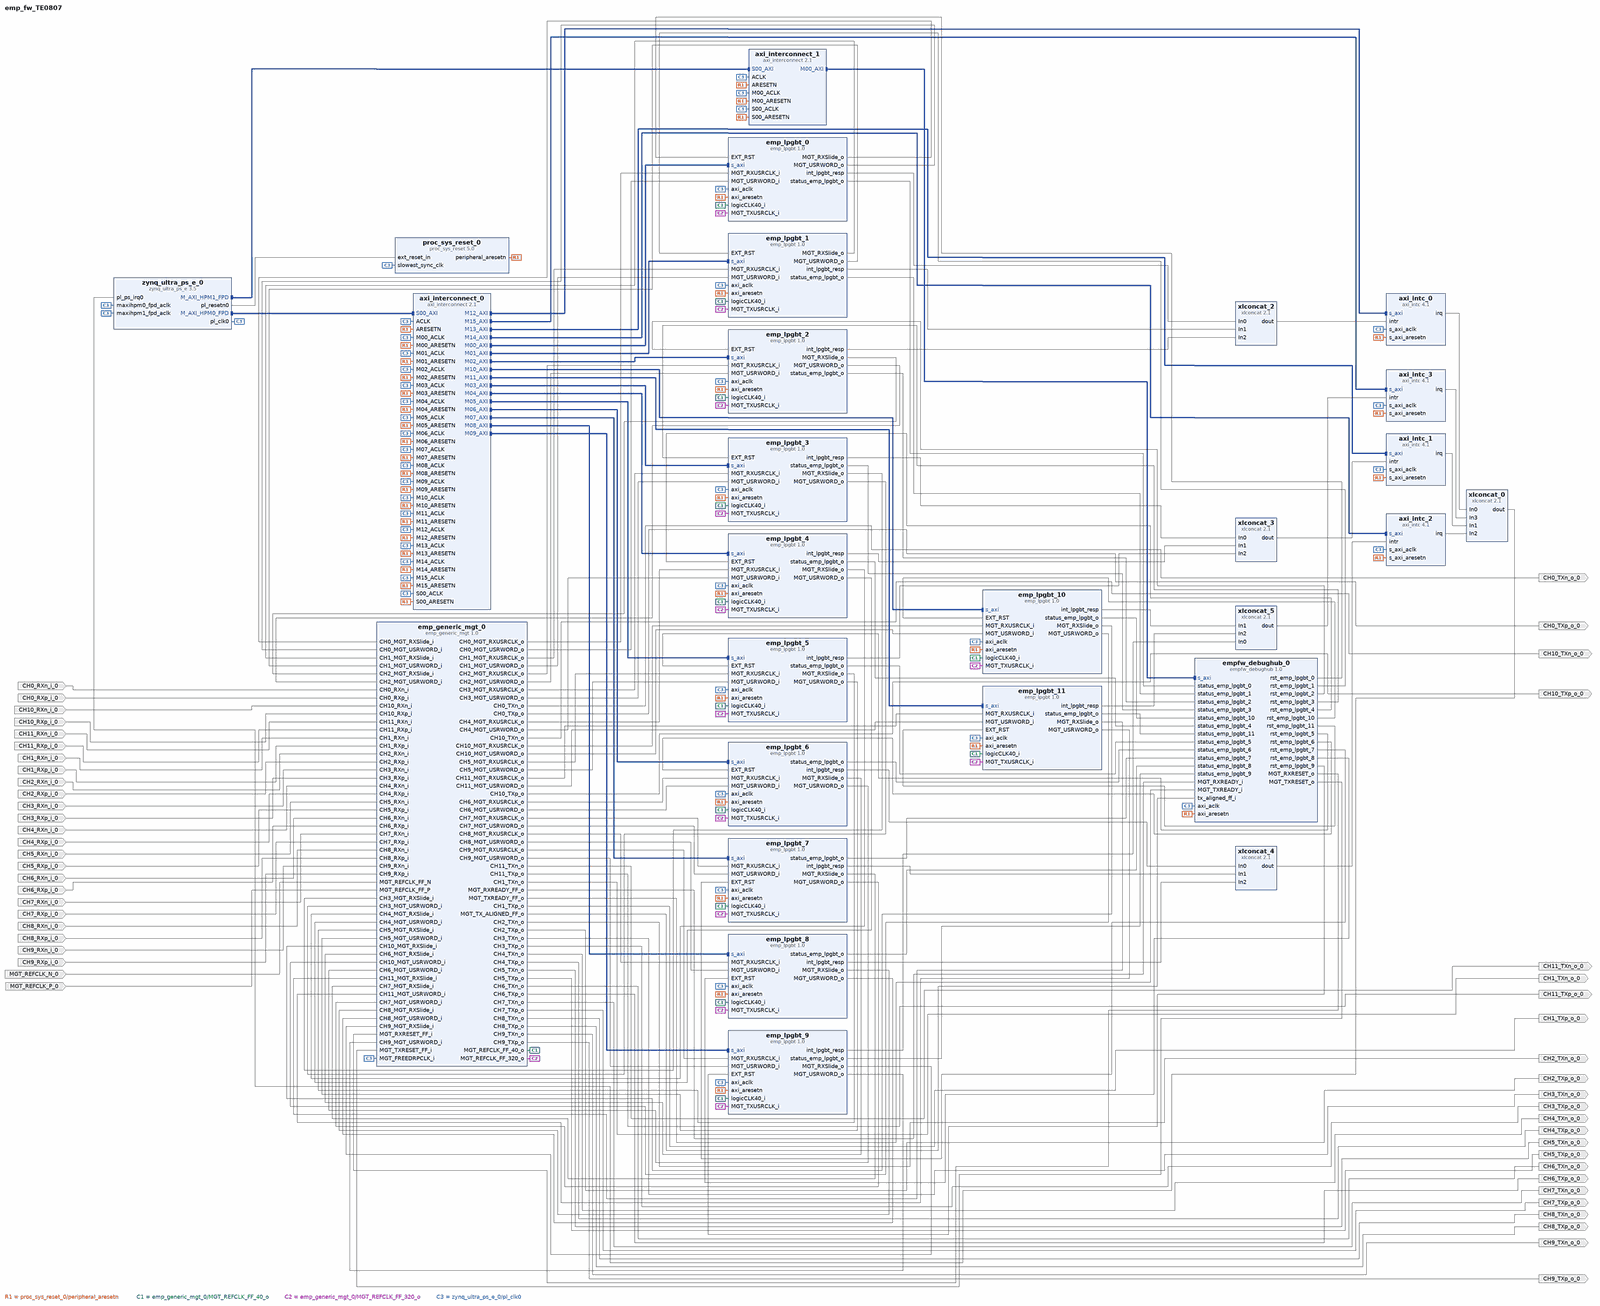
[diagram p0: block diagram of the top level, whole]
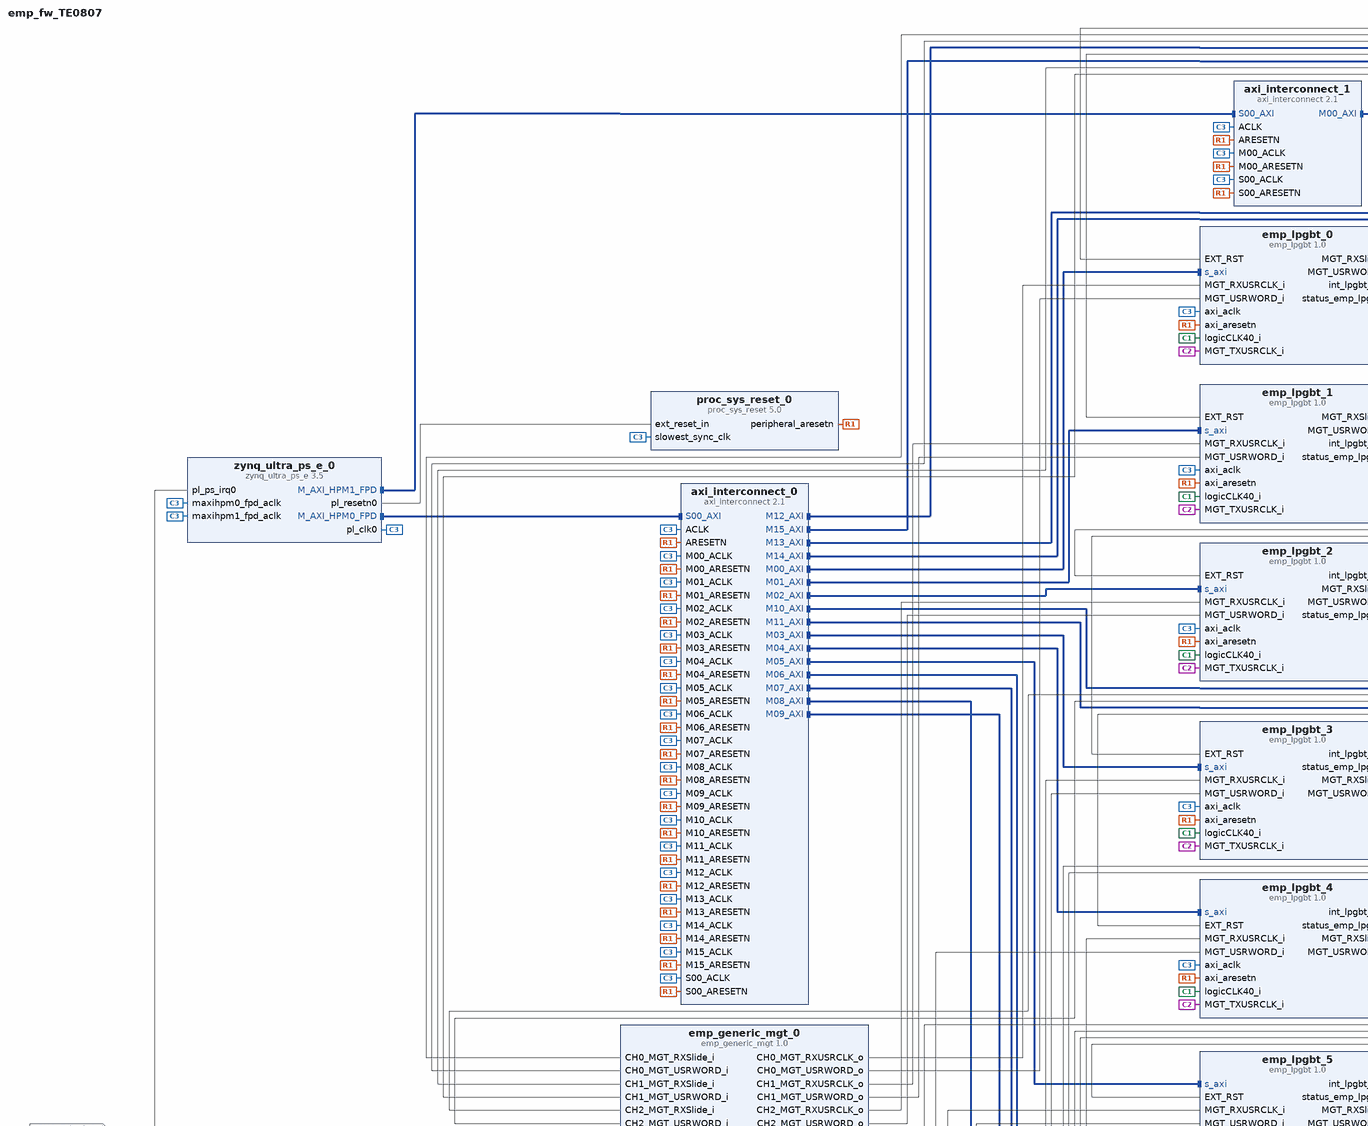
[diagram p1: block diagram of the top level, upper left part]
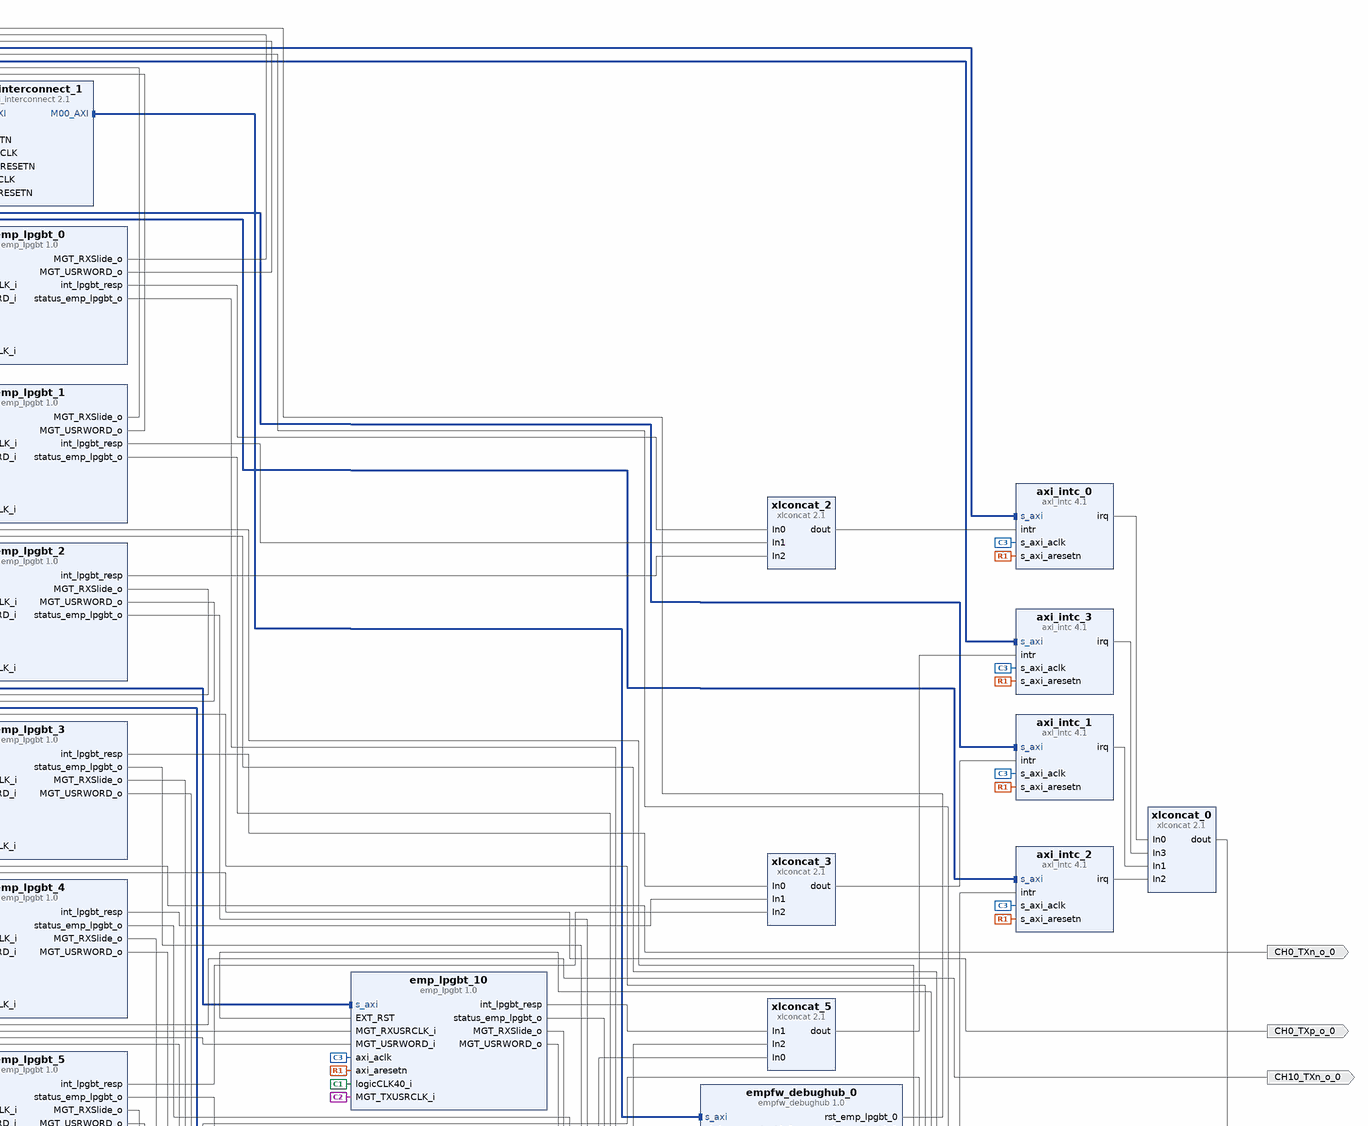
[diagram p2: block diagram of the top level, upper right part]
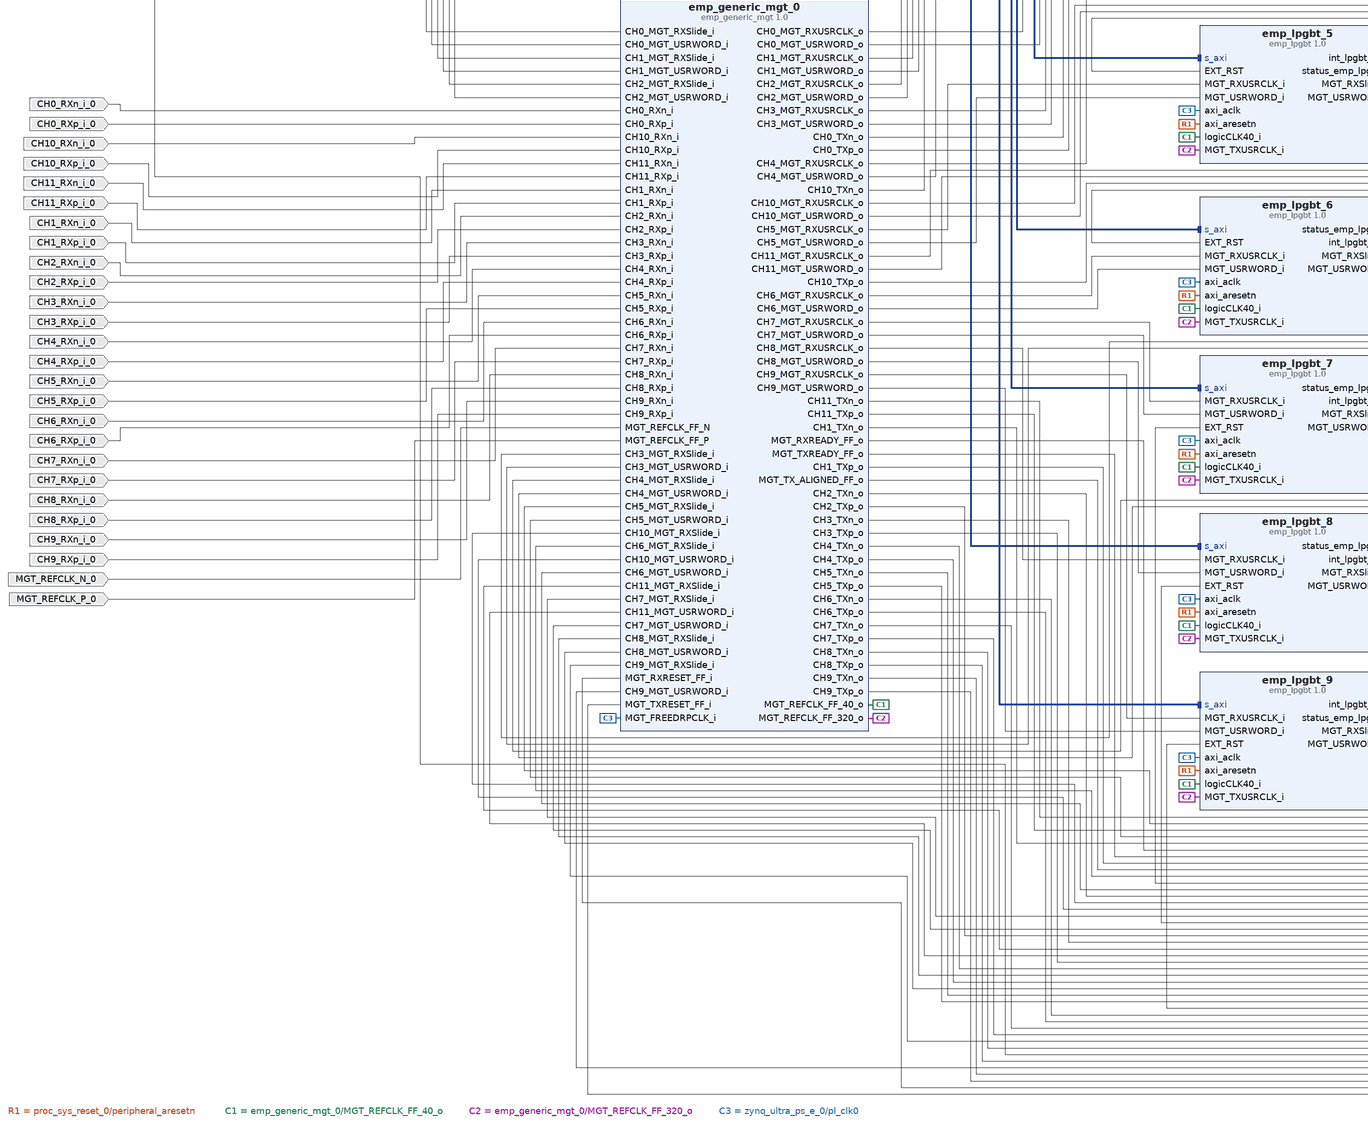
[diagram p3: block diagram of the top level, lower left part]
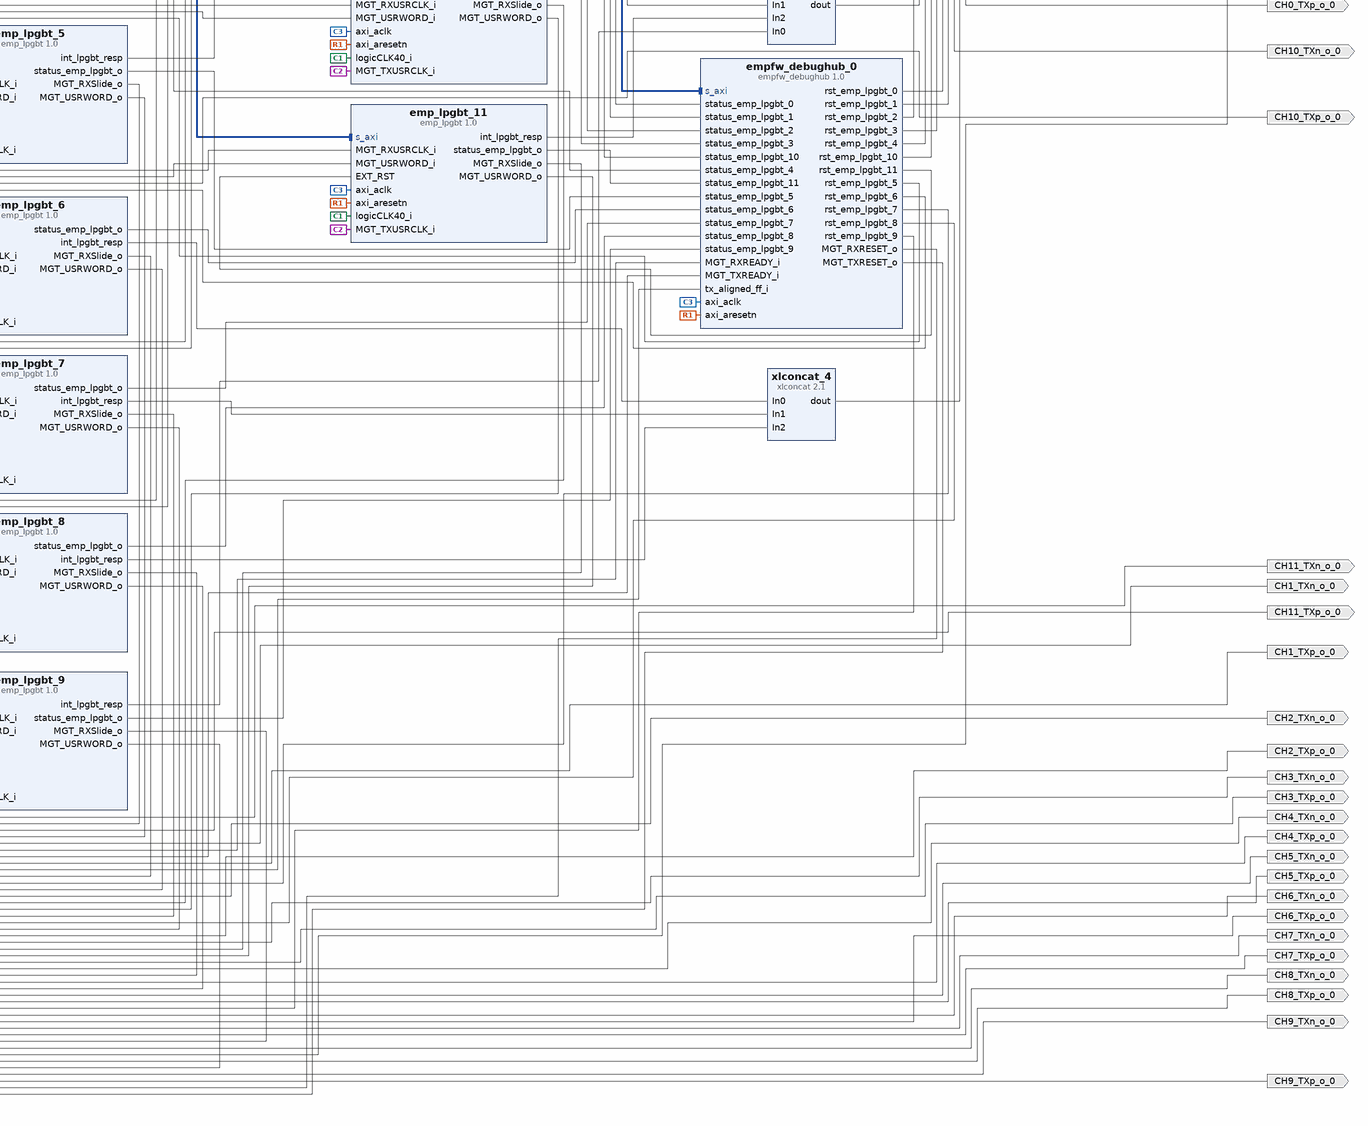
[diagram p4: block diagram of the top level, lower right part]
# Vivado block design emp_fw_TE0807, xczu4eg-fbvb900-1-e, Vivado 2023.2
create_bd_design emp_fw_TE0807

create_bd_port -dir O CH0_TXn_o_0
create_bd_port -dir O CH0_TXp_o_0
create_bd_port -dir O CH1_TXn_o_0
create_bd_port -dir O CH1_TXp_o_0
create_bd_port -dir O CH2_TXn_o_0
create_bd_port -dir O CH2_TXp_o_0
create_bd_port -dir O CH3_TXn_o_0
create_bd_port -dir O CH3_TXp_o_0
create_bd_port -dir O CH4_TXn_o_0
create_bd_port -dir O CH4_TXp_o_0
create_bd_port -dir O CH5_TXn_o_0
create_bd_port -dir O CH5_TXp_o_0
create_bd_port -dir O CH6_TXn_o_0
create_bd_port -dir O CH6_TXp_o_0
create_bd_port -dir O CH7_TXn_o_0
create_bd_port -dir O CH7_TXp_o_0
create_bd_port -dir O CH8_TXn_o_0
create_bd_port -dir O CH8_TXp_o_0
create_bd_port -dir O CH9_TXn_o_0
create_bd_port -dir O CH9_TXp_o_0
create_bd_port -dir O CH10_TXn_o_0
create_bd_port -dir O CH10_TXp_o_0
create_bd_port -dir O CH11_TXn_o_0
create_bd_port -dir O CH11_TXp_o_0
create_bd_port -dir I CH0_RXn_i_0
create_bd_port -dir I CH0_RXp_i_0
create_bd_port -dir I CH1_RXn_i_0
create_bd_port -dir I CH1_RXp_i_0
create_bd_port -dir I CH2_RXn_i_0
create_bd_port -dir I CH2_RXp_i_0
create_bd_port -dir I CH3_RXn_i_0
create_bd_port -dir I CH3_RXp_i_0
create_bd_port -dir I CH4_RXn_i_0
create_bd_port -dir I CH4_RXp_i_0
create_bd_port -dir I CH5_RXn_i_0
create_bd_port -dir I CH5_RXp_i_0
create_bd_port -dir I CH6_RXn_i_0
create_bd_port -dir I CH6_RXp_i_0
create_bd_port -dir I CH7_RXn_i_0
create_bd_port -dir I CH7_RXp_i_0
create_bd_port -dir I CH8_RXn_i_0
create_bd_port -dir I CH8_RXp_i_0
create_bd_port -dir I CH9_RXn_i_0
create_bd_port -dir I CH9_RXp_i_0
create_bd_port -dir I CH10_RXn_i_0
create_bd_port -dir I CH10_RXp_i_0
create_bd_port -dir I CH11_RXn_i_0
create_bd_port -dir I CH11_RXp_i_0
create_bd_port -dir I -type clk MGT_REFCLK_N_0
set_property -dict {CONFIG.FREQ_HZ 320000000} [get_bd_ports MGT_REFCLK_N_0]
create_bd_port -dir I -type clk MGT_REFCLK_P_0
set_property -dict {CONFIG.FREQ_HZ 320000000} [get_bd_ports MGT_REFCLK_P_0]

create_bd_cell -type ip -vlnv xilinx.com:ip:zynq_ultra_ps_e:3.5 zynq_ultra_ps_e_0
set_property -dict [list \
  CONFIG.CAN0_BOARD_INTERFACE custom \
  CONFIG.CAN1_BOARD_INTERFACE custom \
  CONFIG.CSU_BOARD_INTERFACE custom \
  CONFIG.DP_BOARD_INTERFACE custom \
  CONFIG.GEM0_BOARD_INTERFACE custom \
  CONFIG.GEM1_BOARD_INTERFACE custom \
  CONFIG.GEM2_BOARD_INTERFACE custom \
  CONFIG.GEM3_BOARD_INTERFACE custom \
  CONFIG.GPIO_BOARD_INTERFACE custom \
  CONFIG.IIC0_BOARD_INTERFACE custom \
  CONFIG.IIC1_BOARD_INTERFACE custom \
  CONFIG.NAND_BOARD_INTERFACE custom \
  CONFIG.PCIE_BOARD_INTERFACE custom \
  CONFIG.PJTAG_BOARD_INTERFACE custom \
  CONFIG.PMU_BOARD_INTERFACE custom \
  CONFIG.PSU_BANK_0_IO_STANDARD LVCMOS33 \
  CONFIG.PSU_BANK_1_IO_STANDARD LVCMOS33 \
  CONFIG.PSU_BANK_2_IO_STANDARD LVCMOS33 \
  CONFIG.PSU_BANK_3_IO_STANDARD LVCMOS33 \
  CONFIG.PSU_USB3__DUAL_CLOCK_ENABLE 1 \
  CONFIG.PSU__CAN1__PERIPHERAL__ENABLE 0 \
  CONFIG.PSU__CRF_APB__ACPU_CTRL__FREQMHZ 1200 \
  CONFIG.PSU__CRF_APB__ACPU_CTRL__SRCSEL APLL \
  CONFIG.PSU__CRF_APB__APLL_CTRL__SRCSEL PSS_REF_CLK \
  CONFIG.PSU__CRF_APB__DBG_FPD_CTRL__FREQMHZ 250 \
  CONFIG.PSU__CRF_APB__DBG_FPD_CTRL__SRCSEL IOPLL \
  CONFIG.PSU__CRF_APB__DBG_TRACE_CTRL__FREQMHZ 250 \
  CONFIG.PSU__CRF_APB__DBG_TRACE_CTRL__SRCSEL IOPLL \
  CONFIG.PSU__CRF_APB__DBG_TSTMP_CTRL__FREQMHZ 250 \
  CONFIG.PSU__CRF_APB__DBG_TSTMP_CTRL__SRCSEL IOPLL \
  CONFIG.PSU__CRF_APB__DDR_CTRL__FREQMHZ 1200 \
  CONFIG.PSU__CRF_APB__DDR_CTRL__SRCSEL DPLL \
  CONFIG.PSU__CRF_APB__DPDMA_REF_CTRL__FREQMHZ 600 \
  CONFIG.PSU__CRF_APB__DPDMA_REF_CTRL__SRCSEL DPLL \
  CONFIG.PSU__CRF_APB__DPLL_CTRL__SRCSEL PSS_REF_CLK \
  CONFIG.PSU__CRF_APB__DP_AUDIO_REF_CTRL__SRCSEL VPLL \
  CONFIG.PSU__CRF_APB__DP_STC_REF_CTRL__SRCSEL VPLL \
  CONFIG.PSU__CRF_APB__DP_VIDEO_REF_CTRL__SRCSEL DPLL \
  CONFIG.PSU__CRF_APB__GDMA_REF_CTRL__FREQMHZ 600 \
  CONFIG.PSU__CRF_APB__GDMA_REF_CTRL__SRCSEL DPLL \
  CONFIG.PSU__CRF_APB__GPU_REF_CTRL__FREQMHZ 600 \
  CONFIG.PSU__CRF_APB__GPU_REF_CTRL__SRCSEL DPLL \
  CONFIG.PSU__CRF_APB__TOPSW_LSBUS_CTRL__FREQMHZ 100 \
  CONFIG.PSU__CRF_APB__TOPSW_LSBUS_CTRL__SRCSEL IOPLL \
  CONFIG.PSU__CRF_APB__TOPSW_MAIN_CTRL__FREQMHZ 533.333 \
  CONFIG.PSU__CRF_APB__TOPSW_MAIN_CTRL__SRCSEL VPLL \
  CONFIG.PSU__CRF_APB__VPLL_CTRL__SRCSEL PSS_REF_CLK \
  CONFIG.PSU__CRL_APB__ADMA_REF_CTRL__FREQMHZ 500 \
  CONFIG.PSU__CRL_APB__ADMA_REF_CTRL__SRCSEL IOPLL \
  CONFIG.PSU__CRL_APB__CAN1_REF_CTRL__FREQMHZ 100 \
  CONFIG.PSU__CRL_APB__CAN1_REF_CTRL__SRCSEL IOPLL \
  CONFIG.PSU__CRL_APB__CPU_R5_CTRL__FREQMHZ 500 \
  CONFIG.PSU__CRL_APB__CPU_R5_CTRL__SRCSEL IOPLL \
  CONFIG.PSU__CRL_APB__DBG_LPD_CTRL__FREQMHZ 250 \
  CONFIG.PSU__CRL_APB__DBG_LPD_CTRL__SRCSEL IOPLL \
  CONFIG.PSU__CRL_APB__GEM3_REF_CTRL__FREQMHZ 125 \
  CONFIG.PSU__CRL_APB__GEM3_REF_CTRL__SRCSEL IOPLL \
  CONFIG.PSU__CRL_APB__I2C0_REF_CTRL__FREQMHZ 100 \
  CONFIG.PSU__CRL_APB__I2C0_REF_CTRL__SRCSEL IOPLL \
  CONFIG.PSU__CRL_APB__I2C1_REF_CTRL__FREQMHZ 100 \
  CONFIG.PSU__CRL_APB__I2C1_REF_CTRL__SRCSEL IOPLL \
  CONFIG.PSU__CRL_APB__IOPLL_CTRL__SRCSEL PSS_REF_CLK \
  CONFIG.PSU__CRL_APB__IOU_SWITCH_CTRL__FREQMHZ 267 \
  CONFIG.PSU__CRL_APB__IOU_SWITCH_CTRL__SRCSEL RPLL \
  CONFIG.PSU__CRL_APB__LPD_LSBUS_CTRL__FREQMHZ 100 \
  CONFIG.PSU__CRL_APB__LPD_LSBUS_CTRL__SRCSEL IOPLL \
  CONFIG.PSU__CRL_APB__LPD_SWITCH_CTRL__FREQMHZ 500 \
  CONFIG.PSU__CRL_APB__LPD_SWITCH_CTRL__SRCSEL IOPLL \
  CONFIG.PSU__CRL_APB__PCAP_CTRL__FREQMHZ 200 \
  CONFIG.PSU__CRL_APB__PCAP_CTRL__SRCSEL IOPLL \
  CONFIG.PSU__CRL_APB__PL0_REF_CTRL__FREQMHZ 100 \
  CONFIG.PSU__CRL_APB__PL0_REF_CTRL__SRCSEL RPLL \
  CONFIG.PSU__CRL_APB__QSPI_REF_CTRL__FREQMHZ 300 \
  CONFIG.PSU__CRL_APB__QSPI_REF_CTRL__SRCSEL IOPLL \
  CONFIG.PSU__CRL_APB__RPLL_CTRL__SRCSEL PSS_REF_CLK \
  CONFIG.PSU__CRL_APB__SDIO1_REF_CTRL__FREQMHZ 200 \
  CONFIG.PSU__CRL_APB__SDIO1_REF_CTRL__SRCSEL RPLL \
  CONFIG.PSU__CRL_APB__TIMESTAMP_REF_CTRL__FREQMHZ 100 \
  CONFIG.PSU__CRL_APB__TIMESTAMP_REF_CTRL__SRCSEL PSS_REF_CLK \
  CONFIG.PSU__CRL_APB__UART0_REF_CTRL__FREQMHZ 100 \
  CONFIG.PSU__CRL_APB__UART0_REF_CTRL__SRCSEL IOPLL \
  CONFIG.PSU__CRL_APB__UART1_REF_CTRL__FREQMHZ 100 \
  CONFIG.PSU__CRL_APB__UART1_REF_CTRL__SRCSEL IOPLL \
  CONFIG.PSU__CRL_APB__USB0_BUS_REF_CTRL__FREQMHZ 250 \
  CONFIG.PSU__CRL_APB__USB0_BUS_REF_CTRL__SRCSEL IOPLL \
  CONFIG.PSU__CRL_APB__USB3_DUAL_REF_CTRL__FREQMHZ 20 \
  CONFIG.PSU__CRL_APB__USB3_DUAL_REF_CTRL__SRCSEL IOPLL \
  CONFIG.PSU__CRL_APB__USB3__ENABLE 1 \
  CONFIG.PSU__CSUPMU__PERIPHERAL__VALID 0 \
  CONFIG.PSU__DDRC__BUS_WIDTH {64 Bit} \
  CONFIG.PSU__DDRC__COMPONENTS Components \
  CONFIG.PSU__DDRC__DEVICE_CAPACITY {8192 MBits} \
  CONFIG.PSU__DDRC__DRAM_WIDTH {16 Bits} \
  CONFIG.PSU__DDRC__ECC Disabled \
  CONFIG.PSU__DDRC__MEMORY_TYPE {DDR 4} \
  CONFIG.PSU__DDRC__SPEED_BIN DDR4_2400P \
  CONFIG.PSU__DDR_HIGH_ADDRESS_GUI_ENABLE 1 \
  CONFIG.PSU__DDR__INTERFACE__FREQMHZ 600.000 \
  CONFIG.PSU__DEVICE_TYPE EG \
  CONFIG.PSU__DISPLAYPORT__PERIPHERAL__ENABLE 0 \
  CONFIG.PSU__DLL__ISUSED 1 \
  CONFIG.PSU__ENET0__GRP_MDIO__ENABLE 1 \
  CONFIG.PSU__ENET0__GRP_MDIO__IO {MIO 76 .. 77} \
  CONFIG.PSU__ENET0__PERIPHERAL__ENABLE 1 \
  CONFIG.PSU__ENET0__PERIPHERAL__IO {MIO 26 .. 37} \
  CONFIG.PSU__ENET3__FIFO__ENABLE 0 \
  CONFIG.PSU__ENET3__GRP_MDIO__ENABLE 0 \
  CONFIG.PSU__ENET3__PERIPHERAL__ENABLE 1 \
  CONFIG.PSU__ENET3__PERIPHERAL__IO {MIO 64 .. 75} \
  CONFIG.PSU__ENET3__PTP__ENABLE 0 \
  CONFIG.PSU__ENET3__TSU__ENABLE 0 \
  CONFIG.PSU__FPGA_PL0_ENABLE 1 \
  CONFIG.PSU__GEM3_COHERENCY 0 \
  CONFIG.PSU__GEM3_ROUTE_THROUGH_FPD 0 \
  CONFIG.PSU__GEM__TSU__ENABLE 0 \
  CONFIG.PSU__GPIO0_MIO__IO {MIO 0 .. 25} \
  CONFIG.PSU__GPIO0_MIO__PERIPHERAL__ENABLE 1 \
  CONFIG.PSU__GPIO1_MIO__PERIPHERAL__ENABLE 0 \
  CONFIG.PSU__I2C0__PERIPHERAL__ENABLE 1 \
  CONFIG.PSU__I2C0__PERIPHERAL__IO {MIO 38 .. 39} \
  CONFIG.PSU__I2C1__PERIPHERAL__ENABLE 0 \
  CONFIG.PSU__IOU_SLCR__IOU_TTC_APB_CLK__TTC0_SEL APB \
  CONFIG.PSU__IOU_SLCR__IOU_TTC_APB_CLK__TTC1_SEL APB \
  CONFIG.PSU__IOU_SLCR__IOU_TTC_APB_CLK__TTC2_SEL APB \
  CONFIG.PSU__IOU_SLCR__IOU_TTC_APB_CLK__TTC3_SEL APB \
  CONFIG.PSU__LPD_SLCR__CSUPMU__FREQMHZ 100 \
  CONFIG.PSU__MAXIGP0__DATA_WIDTH 128 \
  CONFIG.PSU__OVERRIDE_HPX_QOS 0 \
  CONFIG.PSU__OVERRIDE__BASIC_CLOCK 0 \
  CONFIG.PSU__PMU__PERIPHERAL__ENABLE 0 \
  CONFIG.PSU__PRESET_APPLIED 0 \
  CONFIG.PSU__PSS_REF_CLK__FREQMHZ 33.333 \
  CONFIG.PSU__QSPI_COHERENCY 0 \
  CONFIG.PSU__QSPI_ROUTE_THROUGH_FPD 0 \
  CONFIG.PSU__QSPI__GRP_FBCLK__ENABLE 1 \
  CONFIG.PSU__QSPI__GRP_FBCLK__IO {MIO 6} \
  CONFIG.PSU__QSPI__PERIPHERAL__DATA_MODE x4 \
  CONFIG.PSU__QSPI__PERIPHERAL__ENABLE 1 \
  CONFIG.PSU__QSPI__PERIPHERAL__IO {MIO 0 .. 12} \
  CONFIG.PSU__QSPI__PERIPHERAL__MODE {Dual Parallel} \
  CONFIG.PSU__SATA__PERIPHERAL__ENABLE 0 \
  CONFIG.PSU__SD0__CLK_200_SDR_OTAP_DLY 0x3 \
  CONFIG.PSU__SD0__CLK_50_DDR_ITAP_DLY 0x12 \
  CONFIG.PSU__SD0__CLK_50_DDR_OTAP_DLY 0x6 \
  CONFIG.PSU__SD0__CLK_50_SDR_ITAP_DLY 0x15 \
  CONFIG.PSU__SD0__CLK_50_SDR_OTAP_DLY 0x6 \
  CONFIG.PSU__SD0__DATA_TRANSFER_MODE 8Bit \
  CONFIG.PSU__SD0__GRP_POW__ENABLE 1 \
  CONFIG.PSU__SD0__GRP_POW__IO {MIO 23} \
  CONFIG.PSU__SD0__PERIPHERAL__ENABLE 1 \
  CONFIG.PSU__SD0__PERIPHERAL__IO {MIO 13 .. 22} \
  CONFIG.PSU__SD0__RESET__ENABLE 1 \
  CONFIG.PSU__SD0__SLOT_TYPE eMMC \
  CONFIG.PSU__SD1_COHERENCY 0 \
  CONFIG.PSU__SD1_ROUTE_THROUGH_FPD 0 \
  CONFIG.PSU__SD1__CLK_50_SDR_ITAP_DLY 0x15 \
  CONFIG.PSU__SD1__CLK_50_SDR_OTAP_DLY 0x5 \
  CONFIG.PSU__SD1__DATA_TRANSFER_MODE 4Bit \
  CONFIG.PSU__SD1__GRP_CD__ENABLE 1 \
  CONFIG.PSU__SD1__GRP_CD__IO {MIO 45} \
  CONFIG.PSU__SD1__GRP_POW__ENABLE 0 \
  CONFIG.PSU__SD1__GRP_WP__ENABLE 1 \
  CONFIG.PSU__SD1__GRP_WP__IO {MIO 44} \
  CONFIG.PSU__SD1__PERIPHERAL__ENABLE 1 \
  CONFIG.PSU__SD1__PERIPHERAL__IO {MIO 46 .. 51} \
  CONFIG.PSU__SD1__SLOT_TYPE {SD 2.0} \
  CONFIG.PSU__SWDT0__CLOCK__ENABLE 0 \
  CONFIG.PSU__SWDT0__PERIPHERAL__ENABLE 1 \
  CONFIG.PSU__SWDT0__RESET__ENABLE 0 \
  CONFIG.PSU__SWDT1__CLOCK__ENABLE 0 \
  CONFIG.PSU__SWDT1__PERIPHERAL__ENABLE 1 \
  CONFIG.PSU__SWDT1__RESET__ENABLE 0 \
  CONFIG.PSU__TSU__BUFG_PORT_PAIR 0 \
  CONFIG.PSU__TTC0__CLOCK__ENABLE 0 \
  CONFIG.PSU__TTC0__PERIPHERAL__ENABLE 1 \
  CONFIG.PSU__TTC0__WAVEOUT__ENABLE 0 \
  CONFIG.PSU__TTC1__CLOCK__ENABLE 0 \
  CONFIG.PSU__TTC1__PERIPHERAL__ENABLE 1 \
  CONFIG.PSU__TTC1__WAVEOUT__ENABLE 0 \
  CONFIG.PSU__TTC2__CLOCK__ENABLE 0 \
  CONFIG.PSU__TTC2__PERIPHERAL__ENABLE 1 \
  CONFIG.PSU__TTC2__WAVEOUT__ENABLE 0 \
  CONFIG.PSU__TTC3__CLOCK__ENABLE 0 \
  CONFIG.PSU__TTC3__PERIPHERAL__ENABLE 1 \
  CONFIG.PSU__TTC3__WAVEOUT__ENABLE 0 \
  CONFIG.PSU__UART0__BAUD_RATE 115200 \
  CONFIG.PSU__UART0__MODEM__ENABLE 0 \
  CONFIG.PSU__UART0__PERIPHERAL__ENABLE 1 \
  CONFIG.PSU__UART0__PERIPHERAL__IO {MIO 42 .. 43} \
  CONFIG.PSU__UART1__PERIPHERAL__ENABLE 0 \
  CONFIG.PSU__USB0_COHERENCY 0 \
  CONFIG.PSU__USB0__PERIPHERAL__ENABLE 1 \
  CONFIG.PSU__USB0__PERIPHERAL__IO {MIO 52 .. 63} \
  CONFIG.PSU__USB0__REF_CLK_FREQ 100 \
  CONFIG.PSU__USB0__REF_CLK_SEL {Ref Clk2} \
  CONFIG.PSU__USB2_0__EMIO__ENABLE 0 \
  CONFIG.PSU__USB3_0__EMIO__ENABLE 0 \
  CONFIG.PSU__USB3_0__PERIPHERAL__ENABLE 1 \
  CONFIG.PSU__USB3_0__PERIPHERAL__IO {GT Lane1} \
  CONFIG.PSU__USB__RESET__MODE {Boot Pin} \
  CONFIG.PSU__USB__RESET__POLARITY {Active Low} \
  CONFIG.PSU__USE__IRQ0 1 \
  CONFIG.PSU__USE__IRQ1 1 \
  CONFIG.PSU__USE__M_AXI_GP0 1 \
  CONFIG.PSU__USE__M_AXI_GP1 1 \
  CONFIG.PSU__USE__M_AXI_GP2 0 \
  CONFIG.QSPI_BOARD_INTERFACE custom \
  CONFIG.SATA_BOARD_INTERFACE custom \
  CONFIG.SD0_BOARD_INTERFACE custom \
  CONFIG.SD1_BOARD_INTERFACE custom \
  CONFIG.SPI0_BOARD_INTERFACE custom \
  CONFIG.SPI1_BOARD_INTERFACE custom \
  CONFIG.SUBPRESET1 Custom \
  CONFIG.SUBPRESET2 Custom \
  CONFIG.SWDT0_BOARD_INTERFACE custom \
  CONFIG.SWDT1_BOARD_INTERFACE custom \
  CONFIG.TRACE_BOARD_INTERFACE custom \
  CONFIG.TTC0_BOARD_INTERFACE custom \
  CONFIG.TTC1_BOARD_INTERFACE custom \
  CONFIG.TTC2_BOARD_INTERFACE custom \
  CONFIG.TTC3_BOARD_INTERFACE custom \
  CONFIG.UART0_BOARD_INTERFACE custom \
  CONFIG.UART1_BOARD_INTERFACE custom \
  CONFIG.USB0_BOARD_INTERFACE custom \
  CONFIG.USB1_BOARD_INTERFACE custom \
  CONFIG.preset None \
] [get_bd_cells zynq_ultra_ps_e_0]
# 714 more settings of zynq_ultra_ps_e_0 are not shown: defaults, MIO pin electricals, DDR timing, and values the tool derives
create_bd_cell -type ip -vlnv user.org:user:emp_lpgbt:1.0 emp_lpgbt_0
create_bd_cell -type ip -vlnv xilinx.com:ip:proc_sys_reset:5.0 proc_sys_reset_0
set_property -dict {CONFIG.C_AUX_RESET_HIGH 0} [get_bd_cells proc_sys_reset_0]
create_bd_cell -type ip -vlnv xilinx.com:ip:axi_interconnect:2.1 axi_interconnect_0
set_property -dict {CONFIG.NUM_MI 16} [get_bd_cells axi_interconnect_0]
create_bd_cell -type ip -vlnv user.org:user:emp_lpgbt:1.0 emp_lpgbt_1
set_property -dict {CONFIG.BASEADDR 0xA0010000} [get_bd_cells emp_lpgbt_1]
create_bd_cell -type ip -vlnv user.org:user:emp_lpgbt:1.0 emp_lpgbt_2
set_property -dict {CONFIG.BASEADDR 0xA0020000} [get_bd_cells emp_lpgbt_2]
create_bd_cell -type ip -vlnv user.org:user:emp_lpgbt:1.0 emp_lpgbt_3
set_property -dict {CONFIG.BASEADDR 0xA0030000} [get_bd_cells emp_lpgbt_3]
create_bd_cell -type ip -vlnv user.org:user:emp_lpgbt:1.0 emp_lpgbt_5
set_property -dict {CONFIG.BASEADDR 0xA0050000} [get_bd_cells emp_lpgbt_5]
create_bd_cell -type ip -vlnv user.org:user:emp_lpgbt:1.0 emp_lpgbt_6
set_property -dict {CONFIG.BASEADDR 0xA0060000} [get_bd_cells emp_lpgbt_6]
create_bd_cell -type ip -vlnv user.org:user:emp_lpgbt:1.0 emp_lpgbt_7
set_property -dict {CONFIG.BASEADDR 0xA0070000} [get_bd_cells emp_lpgbt_7]
create_bd_cell -type ip -vlnv user.org:user:emp_lpgbt:1.0 emp_lpgbt_8
set_property -dict {CONFIG.BASEADDR 0xA0080000} [get_bd_cells emp_lpgbt_8]
create_bd_cell -type ip -vlnv user.org:user:emp_lpgbt:1.0 emp_lpgbt_9
set_property -dict {CONFIG.BASEADDR 0xA0090000} [get_bd_cells emp_lpgbt_9]
create_bd_cell -type ip -vlnv user.org:user:emp_lpgbt:1.0 emp_lpgbt_10
set_property -dict {CONFIG.BASEADDR 0xA00A0000} [get_bd_cells emp_lpgbt_10]
create_bd_cell -type ip -vlnv user.org:user:emp_lpgbt:1.0 emp_lpgbt_11
set_property -dict {CONFIG.BASEADDR 0xA00B0000} [get_bd_cells emp_lpgbt_11]
create_bd_cell -type ip -vlnv xilinx.com:ip:xlconcat:2.1 xlconcat_0
set_property -dict {CONFIG.NUM_PORTS 4} [get_bd_cells xlconcat_0]
create_bd_cell -type ip -vlnv xilinx.com:ip:axi_interconnect:2.1 axi_interconnect_1
set_property -dict {CONFIG.NUM_MI 1} [get_bd_cells axi_interconnect_1]
create_bd_cell -type ip -vlnv user.org:user:emp_lpgbt:1.0 emp_lpgbt_4
set_property -dict {CONFIG.BASEADDR 0xA0040000} [get_bd_cells emp_lpgbt_4]
create_bd_cell -type ip -vlnv user.org:user:empfw_debughub:1.0 empfw_debughub_0
create_bd_cell -type ip -vlnv user.org:user:emp_generic_mgt:1.0 emp_generic_mgt_0
set_property -dict [list \
  CONFIG.g_COM_SEL 0 \
  CONFIG.g_MGT_FF_RX_POLARITY_inv 0xE07 \
  CONFIG.g_MGT_FF_TX_POLARITY_inv 0xFFF \
] [get_bd_cells emp_generic_mgt_0]
create_bd_cell -type ip -vlnv xilinx.com:ip:xlconcat:2.1 xlconcat_2
set_property -dict {CONFIG.NUM_PORTS 3} [get_bd_cells xlconcat_2]
create_bd_cell -type ip -vlnv xilinx.com:ip:xlconcat:2.1 xlconcat_3
set_property -dict {CONFIG.NUM_PORTS 3} [get_bd_cells xlconcat_3]
create_bd_cell -type ip -vlnv xilinx.com:ip:xlconcat:2.1 xlconcat_4
set_property -dict {CONFIG.NUM_PORTS 3} [get_bd_cells xlconcat_4]
create_bd_cell -type ip -vlnv xilinx.com:ip:xlconcat:2.1 xlconcat_5
set_property -dict {CONFIG.NUM_PORTS 3} [get_bd_cells xlconcat_5]
create_bd_cell -type ip -vlnv xilinx.com:ip:axi_intc:4.1 axi_intc_0
set_property -dict {CONFIG.C_IRQ_CONNECTION 1} [get_bd_cells axi_intc_0]
create_bd_cell -type ip -vlnv xilinx.com:ip:axi_intc:4.1 axi_intc_1
set_property -dict {CONFIG.C_IRQ_CONNECTION 1} [get_bd_cells axi_intc_1]
create_bd_cell -type ip -vlnv xilinx.com:ip:axi_intc:4.1 axi_intc_2
set_property -dict {CONFIG.C_IRQ_CONNECTION 1} [get_bd_cells axi_intc_2]
create_bd_cell -type ip -vlnv xilinx.com:ip:axi_intc:4.1 axi_intc_3
set_property -dict {CONFIG.C_IRQ_CONNECTION 1} [get_bd_cells axi_intc_3]

# ---- connections ----

connect_bd_intf_net [get_bd_intf_pins emp_lpgbt_0/s_axi] [get_bd_intf_pins axi_interconnect_0/M00_AXI]
connect_bd_intf_net [get_bd_intf_pins emp_lpgbt_1/s_axi] [get_bd_intf_pins axi_interconnect_0/M01_AXI]
connect_bd_intf_net [get_bd_intf_pins emp_lpgbt_2/s_axi] [get_bd_intf_pins axi_interconnect_0/M02_AXI]
connect_bd_intf_net [get_bd_intf_pins emp_lpgbt_3/s_axi] [get_bd_intf_pins axi_interconnect_0/M03_AXI]
connect_bd_intf_net [get_bd_intf_pins emp_lpgbt_4/s_axi] [get_bd_intf_pins axi_interconnect_0/M04_AXI]
connect_bd_intf_net [get_bd_intf_pins emp_lpgbt_5/s_axi] [get_bd_intf_pins axi_interconnect_0/M05_AXI]
connect_bd_intf_net [get_bd_intf_pins emp_lpgbt_6/s_axi] [get_bd_intf_pins axi_interconnect_0/M06_AXI]
connect_bd_intf_net [get_bd_intf_pins emp_lpgbt_7/s_axi] [get_bd_intf_pins axi_interconnect_0/M07_AXI]
connect_bd_intf_net [get_bd_intf_pins emp_lpgbt_8/s_axi] [get_bd_intf_pins axi_interconnect_0/M08_AXI]
connect_bd_intf_net [get_bd_intf_pins emp_lpgbt_9/s_axi] [get_bd_intf_pins axi_interconnect_0/M09_AXI]
connect_bd_intf_net [get_bd_intf_pins emp_lpgbt_10/s_axi] [get_bd_intf_pins axi_interconnect_0/M10_AXI]
connect_bd_intf_net [get_bd_intf_pins emp_lpgbt_11/s_axi] [get_bd_intf_pins axi_interconnect_0/M11_AXI]
connect_bd_intf_net [get_bd_intf_pins axi_intc_0/s_axi] [get_bd_intf_pins axi_interconnect_0/M12_AXI]
connect_bd_intf_net [get_bd_intf_pins axi_intc_1/s_axi] [get_bd_intf_pins axi_interconnect_0/M13_AXI]
connect_bd_intf_net [get_bd_intf_pins axi_intc_2/s_axi] [get_bd_intf_pins axi_interconnect_0/M14_AXI]
connect_bd_intf_net [get_bd_intf_pins axi_intc_3/s_axi] [get_bd_intf_pins axi_interconnect_0/M15_AXI]
connect_bd_intf_net [get_bd_intf_pins axi_interconnect_1/M00_AXI] [get_bd_intf_pins empfw_debughub_0/s_axi]
connect_bd_intf_net [get_bd_intf_pins zynq_ultra_ps_e_0/M_AXI_HPM0_FPD] [get_bd_intf_pins axi_interconnect_0/S00_AXI]
connect_bd_intf_net [get_bd_intf_pins zynq_ultra_ps_e_0/M_AXI_HPM1_FPD] [get_bd_intf_pins axi_interconnect_1/S00_AXI]
connect_bd_net -net CH0_RXn_i_0_1 [get_bd_ports CH0_RXn_i_0] [get_bd_pins emp_generic_mgt_0/CH0_RXn_i]
connect_bd_net -net CH0_RXp_i_0_1 [get_bd_ports CH0_RXp_i_0] [get_bd_pins emp_generic_mgt_0/CH0_RXp_i]
connect_bd_net -net CH10_RXn_i_0_1 [get_bd_ports CH10_RXn_i_0] [get_bd_pins emp_generic_mgt_0/CH10_RXn_i]
connect_bd_net -net CH10_RXp_i_0_1 [get_bd_ports CH10_RXp_i_0] [get_bd_pins emp_generic_mgt_0/CH10_RXp_i]
connect_bd_net -net CH11_RXn_i_0_1 [get_bd_ports CH11_RXn_i_0] [get_bd_pins emp_generic_mgt_0/CH11_RXn_i]
connect_bd_net -net CH11_RXp_i_0_1 [get_bd_ports CH11_RXp_i_0] [get_bd_pins emp_generic_mgt_0/CH11_RXp_i]
connect_bd_net -net CH1_RXn_i_0_1 [get_bd_ports CH1_RXn_i_0] [get_bd_pins emp_generic_mgt_0/CH1_RXn_i]
connect_bd_net -net CH1_RXp_i_0_1 [get_bd_ports CH1_RXp_i_0] [get_bd_pins emp_generic_mgt_0/CH1_RXp_i]
connect_bd_net -net CH2_RXn_i_0_1 [get_bd_ports CH2_RXn_i_0] [get_bd_pins emp_generic_mgt_0/CH2_RXn_i]
connect_bd_net -net CH2_RXp_i_0_1 [get_bd_ports CH2_RXp_i_0] [get_bd_pins emp_generic_mgt_0/CH2_RXp_i]
connect_bd_net -net CH3_RXn_i_0_1 [get_bd_ports CH3_RXn_i_0] [get_bd_pins emp_generic_mgt_0/CH3_RXn_i]
connect_bd_net -net CH3_RXp_i_0_1 [get_bd_ports CH3_RXp_i_0] [get_bd_pins emp_generic_mgt_0/CH3_RXp_i]
connect_bd_net -net CH4_RXn_i_0_1 [get_bd_ports CH4_RXn_i_0] [get_bd_pins emp_generic_mgt_0/CH4_RXn_i]
connect_bd_net -net CH4_RXp_i_0_1 [get_bd_ports CH4_RXp_i_0] [get_bd_pins emp_generic_mgt_0/CH4_RXp_i]
connect_bd_net -net CH5_RXn_i_0_1 [get_bd_ports CH5_RXn_i_0] [get_bd_pins emp_generic_mgt_0/CH5_RXn_i]
connect_bd_net -net CH5_RXp_i_0_1 [get_bd_ports CH5_RXp_i_0] [get_bd_pins emp_generic_mgt_0/CH5_RXp_i]
connect_bd_net -net CH6_RXn_i_0_1 [get_bd_ports CH6_RXn_i_0] [get_bd_pins emp_generic_mgt_0/CH6_RXn_i]
connect_bd_net -net CH6_RXp_i_0_1 [get_bd_ports CH6_RXp_i_0] [get_bd_pins emp_generic_mgt_0/CH6_RXp_i]
connect_bd_net -net CH7_RXn_i_0_1 [get_bd_ports CH7_RXn_i_0] [get_bd_pins emp_generic_mgt_0/CH7_RXn_i]
connect_bd_net -net CH7_RXp_i_0_1 [get_bd_ports CH7_RXp_i_0] [get_bd_pins emp_generic_mgt_0/CH7_RXp_i]
connect_bd_net -net CH8_RXn_i_0_1 [get_bd_ports CH8_RXn_i_0] [get_bd_pins emp_generic_mgt_0/CH8_RXn_i]
connect_bd_net -net CH8_RXp_i_0_1 [get_bd_ports CH8_RXp_i_0] [get_bd_pins emp_generic_mgt_0/CH8_RXp_i]
connect_bd_net -net CH9_RXn_i_0_1 [get_bd_ports CH9_RXn_i_0] [get_bd_pins emp_generic_mgt_0/CH9_RXn_i]
connect_bd_net -net CH9_RXp_i_0_1 [get_bd_ports CH9_RXp_i_0] [get_bd_pins emp_generic_mgt_0/CH9_RXp_i]
connect_bd_net -net M12_ARESETN_1 [get_bd_pins proc_sys_reset_0/peripheral_aresetn] \
  [get_bd_pins axi_interconnect_0/M11_ARESETN] [get_bd_pins axi_interconnect_0/M10_ARESETN] \
  [get_bd_pins axi_interconnect_0/M09_ARESETN] [get_bd_pins axi_interconnect_0/M08_ARESETN] \
  [get_bd_pins axi_interconnect_0/M07_ARESETN] [get_bd_pins axi_interconnect_0/M06_ARESETN] \
  [get_bd_pins axi_interconnect_0/M05_ARESETN] [get_bd_pins axi_interconnect_0/M04_ARESETN] \
  [get_bd_pins axi_interconnect_0/M03_ARESETN] [get_bd_pins axi_interconnect_0/M02_ARESETN] \
  [get_bd_pins axi_interconnect_0/M01_ARESETN] [get_bd_pins axi_interconnect_0/M00_ARESETN] \
  [get_bd_pins axi_interconnect_0/S00_ARESETN] [get_bd_pins axi_interconnect_0/ARESETN] \
  [get_bd_pins axi_interconnect_1/ARESETN] [get_bd_pins axi_interconnect_1/S00_ARESETN] \
  [get_bd_pins axi_interconnect_1/M00_ARESETN] [get_bd_pins emp_lpgbt_0/axi_aresetn] [get_bd_pins emp_lpgbt_10/axi_aresetn] \
  [get_bd_pins emp_lpgbt_11/axi_aresetn] [get_bd_pins emp_lpgbt_1/axi_aresetn] [get_bd_pins emp_lpgbt_2/axi_aresetn] \
  [get_bd_pins emp_lpgbt_3/axi_aresetn] [get_bd_pins emp_lpgbt_4/axi_aresetn] [get_bd_pins emp_lpgbt_5/axi_aresetn] \
  [get_bd_pins emp_lpgbt_6/axi_aresetn] [get_bd_pins emp_lpgbt_7/axi_aresetn] [get_bd_pins emp_lpgbt_8/axi_aresetn] \
  [get_bd_pins emp_lpgbt_9/axi_aresetn] [get_bd_pins empfw_debughub_0/axi_aresetn] [get_bd_pins axi_intc_3/s_axi_aresetn] \
  [get_bd_pins axi_intc_2/s_axi_aresetn] [get_bd_pins axi_intc_1/s_axi_aresetn] [get_bd_pins axi_intc_0/s_axi_aresetn] \
  [get_bd_pins axi_interconnect_0/M15_ARESETN] [get_bd_pins axi_interconnect_0/M14_ARESETN] \
  [get_bd_pins axi_interconnect_0/M13_ARESETN] [get_bd_pins axi_interconnect_0/M12_ARESETN]
connect_bd_net -net MGT_REFCLK_N_0_1 [get_bd_ports MGT_REFCLK_N_0] [get_bd_pins emp_generic_mgt_0/MGT_REFCLK_FF_N]
connect_bd_net -net MGT_REFCLK_P_0_1 [get_bd_ports MGT_REFCLK_P_0] [get_bd_pins emp_generic_mgt_0/MGT_REFCLK_FF_P]
connect_bd_net [get_bd_pins emp_generic_mgt_0/MGT_REFCLK_FF_40_o] \
  [get_bd_pins emp_lpgbt_7/logicCLK40_i] [get_bd_pins emp_lpgbt_6/logicCLK40_i] [get_bd_pins emp_lpgbt_2/logicCLK40_i] \
  [get_bd_pins emp_lpgbt_1/logicCLK40_i] [get_bd_pins emp_lpgbt_0/logicCLK40_i] [get_bd_pins emp_lpgbt_3/logicCLK40_i] \
  [get_bd_pins emp_lpgbt_4/logicCLK40_i] [get_bd_pins emp_lpgbt_8/logicCLK40_i] [get_bd_pins emp_lpgbt_11/logicCLK40_i] \
  [get_bd_pins emp_lpgbt_9/logicCLK40_i] [get_bd_pins emp_lpgbt_5/logicCLK40_i] [get_bd_pins emp_lpgbt_10/logicCLK40_i]
connect_bd_net [get_bd_pins emp_generic_mgt_0/MGT_REFCLK_FF_320_o] \
  [get_bd_pins emp_lpgbt_0/MGT_TXUSRCLK_i] [get_bd_pins emp_lpgbt_10/MGT_TXUSRCLK_i] \
  [get_bd_pins emp_lpgbt_11/MGT_TXUSRCLK_i] [get_bd_pins emp_lpgbt_1/MGT_TXUSRCLK_i] [get_bd_pins emp_lpgbt_2/MGT_TXUSRCLK_i] \
  [get_bd_pins emp_lpgbt_3/MGT_TXUSRCLK_i] [get_bd_pins emp_lpgbt_4/MGT_TXUSRCLK_i] [get_bd_pins emp_lpgbt_5/MGT_TXUSRCLK_i] \
  [get_bd_pins emp_lpgbt_6/MGT_TXUSRCLK_i] [get_bd_pins emp_lpgbt_7/MGT_TXUSRCLK_i] [get_bd_pins emp_lpgbt_8/MGT_TXUSRCLK_i] \
  [get_bd_pins emp_lpgbt_9/MGT_TXUSRCLK_i]
connect_bd_net [get_bd_pins axi_intc_0/irq] [get_bd_pins xlconcat_0/In0]
connect_bd_net [get_bd_pins axi_intc_1/irq] [get_bd_pins xlconcat_0/In1]
connect_bd_net [get_bd_pins axi_intc_2/irq] [get_bd_pins xlconcat_0/In2]
connect_bd_net [get_bd_pins axi_intc_3/irq] [get_bd_pins xlconcat_0/In3]
connect_bd_net [get_bd_pins emp_generic_mgt_0/CH0_MGT_RXUSRCLK_o] [get_bd_pins emp_lpgbt_0/MGT_RXUSRCLK_i]
connect_bd_net [get_bd_pins emp_generic_mgt_0/CH0_MGT_USRWORD_o] [get_bd_pins emp_lpgbt_0/MGT_USRWORD_i]
connect_bd_net [get_bd_pins emp_generic_mgt_0/CH0_TXn_o] [get_bd_ports CH0_TXn_o_0]
connect_bd_net [get_bd_pins emp_generic_mgt_0/CH0_TXp_o] [get_bd_ports CH0_TXp_o_0]
connect_bd_net [get_bd_pins emp_generic_mgt_0/CH10_MGT_RXUSRCLK_o] [get_bd_pins emp_lpgbt_10/MGT_RXUSRCLK_i]
connect_bd_net [get_bd_pins emp_generic_mgt_0/CH10_MGT_USRWORD_o] [get_bd_pins emp_lpgbt_10/MGT_USRWORD_i]
connect_bd_net [get_bd_pins emp_generic_mgt_0/CH10_TXn_o] [get_bd_ports CH10_TXn_o_0]
connect_bd_net [get_bd_pins emp_generic_mgt_0/CH10_TXp_o] [get_bd_ports CH10_TXp_o_0]
connect_bd_net [get_bd_pins emp_generic_mgt_0/CH11_MGT_RXUSRCLK_o] [get_bd_pins emp_lpgbt_11/MGT_RXUSRCLK_i]
connect_bd_net [get_bd_pins emp_generic_mgt_0/CH11_MGT_USRWORD_o] [get_bd_pins emp_lpgbt_11/MGT_USRWORD_i]
connect_bd_net [get_bd_pins emp_generic_mgt_0/CH11_TXn_o] [get_bd_ports CH11_TXn_o_0]
connect_bd_net [get_bd_pins emp_generic_mgt_0/CH11_TXp_o] [get_bd_ports CH11_TXp_o_0]
connect_bd_net [get_bd_pins emp_generic_mgt_0/CH1_MGT_RXUSRCLK_o] [get_bd_pins emp_lpgbt_1/MGT_RXUSRCLK_i]
connect_bd_net [get_bd_pins emp_generic_mgt_0/CH1_MGT_USRWORD_o] [get_bd_pins emp_lpgbt_1/MGT_USRWORD_i]
connect_bd_net [get_bd_pins emp_generic_mgt_0/CH1_TXn_o] [get_bd_ports CH1_TXn_o_0]
connect_bd_net [get_bd_pins emp_generic_mgt_0/CH1_TXp_o] [get_bd_ports CH1_TXp_o_0]
connect_bd_net [get_bd_pins emp_generic_mgt_0/CH2_MGT_RXUSRCLK_o] [get_bd_pins emp_lpgbt_2/MGT_RXUSRCLK_i]
connect_bd_net [get_bd_pins emp_generic_mgt_0/CH2_MGT_USRWORD_o] [get_bd_pins emp_lpgbt_2/MGT_USRWORD_i]
connect_bd_net [get_bd_pins emp_generic_mgt_0/CH2_TXn_o] [get_bd_ports CH2_TXn_o_0]
connect_bd_net [get_bd_pins emp_generic_mgt_0/CH2_TXp_o] [get_bd_ports CH2_TXp_o_0]
connect_bd_net [get_bd_pins emp_generic_mgt_0/CH3_MGT_RXUSRCLK_o] [get_bd_pins emp_lpgbt_3/MGT_RXUSRCLK_i]
connect_bd_net [get_bd_pins emp_generic_mgt_0/CH3_MGT_USRWORD_o] [get_bd_pins emp_lpgbt_3/MGT_USRWORD_i]
connect_bd_net [get_bd_pins emp_generic_mgt_0/CH3_TXn_o] [get_bd_ports CH3_TXn_o_0]
connect_bd_net [get_bd_pins emp_generic_mgt_0/CH3_TXp_o] [get_bd_ports CH3_TXp_o_0]
connect_bd_net [get_bd_pins emp_generic_mgt_0/CH4_MGT_RXUSRCLK_o] [get_bd_pins emp_lpgbt_4/MGT_RXUSRCLK_i]
connect_bd_net [get_bd_pins emp_generic_mgt_0/CH4_MGT_USRWORD_o] [get_bd_pins emp_lpgbt_4/MGT_USRWORD_i]
connect_bd_net [get_bd_pins emp_generic_mgt_0/CH4_TXn_o] [get_bd_ports CH4_TXn_o_0]
connect_bd_net [get_bd_pins emp_generic_mgt_0/CH4_TXp_o] [get_bd_ports CH4_TXp_o_0]
connect_bd_net [get_bd_pins emp_generic_mgt_0/CH5_MGT_RXUSRCLK_o] [get_bd_pins emp_lpgbt_5/MGT_RXUSRCLK_i]
connect_bd_net [get_bd_pins emp_generic_mgt_0/CH5_MGT_USRWORD_o] [get_bd_pins emp_lpgbt_5/MGT_USRWORD_i]
connect_bd_net [get_bd_pins emp_generic_mgt_0/CH5_TXn_o] [get_bd_ports CH5_TXn_o_0]
connect_bd_net [get_bd_pins emp_generic_mgt_0/CH5_TXp_o] [get_bd_ports CH5_TXp_o_0]
connect_bd_net [get_bd_pins emp_generic_mgt_0/CH6_MGT_RXUSRCLK_o] [get_bd_pins emp_lpgbt_6/MGT_RXUSRCLK_i]
connect_bd_net [get_bd_pins emp_generic_mgt_0/CH6_MGT_USRWORD_o] [get_bd_pins emp_lpgbt_6/MGT_USRWORD_i]
connect_bd_net [get_bd_pins emp_generic_mgt_0/CH6_TXn_o] [get_bd_ports CH6_TXn_o_0]
connect_bd_net [get_bd_pins emp_generic_mgt_0/CH6_TXp_o] [get_bd_ports CH6_TXp_o_0]
connect_bd_net [get_bd_pins emp_generic_mgt_0/CH7_MGT_RXUSRCLK_o] [get_bd_pins emp_lpgbt_7/MGT_RXUSRCLK_i]
connect_bd_net [get_bd_pins emp_generic_mgt_0/CH7_MGT_USRWORD_o] [get_bd_pins emp_lpgbt_7/MGT_USRWORD_i]
connect_bd_net [get_bd_pins emp_generic_mgt_0/CH7_TXn_o] [get_bd_ports CH7_TXn_o_0]
connect_bd_net [get_bd_pins emp_generic_mgt_0/CH7_TXp_o] [get_bd_ports CH7_TXp_o_0]
connect_bd_net [get_bd_pins emp_generic_mgt_0/CH8_MGT_RXUSRCLK_o] [get_bd_pins emp_lpgbt_8/MGT_RXUSRCLK_i]
connect_bd_net [get_bd_pins emp_generic_mgt_0/CH8_MGT_USRWORD_o] [get_bd_pins emp_lpgbt_8/MGT_USRWORD_i]
connect_bd_net [get_bd_pins emp_generic_mgt_0/CH8_TXn_o] [get_bd_ports CH8_TXn_o_0]
connect_bd_net [get_bd_pins emp_generic_mgt_0/CH8_TXp_o] [get_bd_ports CH8_TXp_o_0]
connect_bd_net [get_bd_pins emp_generic_mgt_0/CH9_MGT_RXUSRCLK_o] [get_bd_pins emp_lpgbt_9/MGT_RXUSRCLK_i]
connect_bd_net [get_bd_pins emp_generic_mgt_0/CH9_MGT_USRWORD_o] [get_bd_pins emp_lpgbt_9/MGT_USRWORD_i]
connect_bd_net [get_bd_pins emp_generic_mgt_0/CH9_TXn_o] [get_bd_ports CH9_TXn_o_0]
connect_bd_net [get_bd_pins emp_generic_mgt_0/CH9_TXp_o] [get_bd_ports CH9_TXp_o_0]
connect_bd_net [get_bd_pins emp_generic_mgt_0/MGT_RXREADY_FF_o] [get_bd_pins empfw_debughub_0/MGT_RXREADY_i]
connect_bd_net [get_bd_pins emp_generic_mgt_0/MGT_TXREADY_FF_o] [get_bd_pins empfw_debughub_0/MGT_TXREADY_i]
connect_bd_net [get_bd_pins emp_generic_mgt_0/MGT_TX_ALIGNED_FF_o] [get_bd_pins empfw_debughub_0/tx_aligned_ff_i]
connect_bd_net [get_bd_pins emp_lpgbt_0/MGT_RXSlide_o] [get_bd_pins emp_generic_mgt_0/CH0_MGT_RXSlide_i]
connect_bd_net [get_bd_pins emp_lpgbt_0/MGT_USRWORD_o] [get_bd_pins emp_generic_mgt_0/CH0_MGT_USRWORD_i]
connect_bd_net [get_bd_pins emp_lpgbt_0/int_lpgbt_resp] [get_bd_pins xlconcat_2/In0]
connect_bd_net [get_bd_pins emp_lpgbt_0/status_emp_lpgbt_o] [get_bd_pins empfw_debughub_0/status_emp_lpgbt_0]
connect_bd_net [get_bd_pins emp_lpgbt_10/MGT_RXSlide_o] [get_bd_pins emp_generic_mgt_0/CH10_MGT_RXSlide_i]
connect_bd_net [get_bd_pins emp_lpgbt_10/MGT_USRWORD_o] [get_bd_pins emp_generic_mgt_0/CH10_MGT_USRWORD_i]
connect_bd_net [get_bd_pins emp_lpgbt_10/int_lpgbt_resp] [get_bd_pins xlconcat_5/In1]
connect_bd_net [get_bd_pins emp_lpgbt_10/status_emp_lpgbt_o] [get_bd_pins empfw_debughub_0/status_emp_lpgbt_10]
connect_bd_net [get_bd_pins emp_lpgbt_11/MGT_RXSlide_o] [get_bd_pins emp_generic_mgt_0/CH11_MGT_RXSlide_i]
connect_bd_net [get_bd_pins emp_lpgbt_11/MGT_USRWORD_o] [get_bd_pins emp_generic_mgt_0/CH11_MGT_USRWORD_i]
connect_bd_net [get_bd_pins emp_lpgbt_11/int_lpgbt_resp] [get_bd_pins xlconcat_5/In2]
connect_bd_net [get_bd_pins emp_lpgbt_11/status_emp_lpgbt_o] [get_bd_pins empfw_debughub_0/status_emp_lpgbt_11]
connect_bd_net [get_bd_pins emp_lpgbt_1/MGT_RXSlide_o] [get_bd_pins emp_generic_mgt_0/CH1_MGT_RXSlide_i]
connect_bd_net [get_bd_pins emp_lpgbt_1/MGT_USRWORD_o] [get_bd_pins emp_generic_mgt_0/CH1_MGT_USRWORD_i]
connect_bd_net [get_bd_pins emp_lpgbt_1/int_lpgbt_resp] [get_bd_pins xlconcat_2/In1]
connect_bd_net [get_bd_pins emp_lpgbt_1/status_emp_lpgbt_o] [get_bd_pins empfw_debughub_0/status_emp_lpgbt_1]
connect_bd_net [get_bd_pins emp_lpgbt_2/MGT_RXSlide_o] [get_bd_pins emp_generic_mgt_0/CH2_MGT_RXSlide_i]
connect_bd_net [get_bd_pins emp_lpgbt_2/MGT_USRWORD_o] [get_bd_pins emp_generic_mgt_0/CH2_MGT_USRWORD_i]
connect_bd_net [get_bd_pins emp_lpgbt_2/int_lpgbt_resp] [get_bd_pins xlconcat_2/In2]
connect_bd_net [get_bd_pins emp_lpgbt_2/status_emp_lpgbt_o] [get_bd_pins empfw_debughub_0/status_emp_lpgbt_2]
connect_bd_net [get_bd_pins emp_lpgbt_3/MGT_RXSlide_o] [get_bd_pins emp_generic_mgt_0/CH3_MGT_RXSlide_i]
connect_bd_net [get_bd_pins emp_lpgbt_3/MGT_USRWORD_o] [get_bd_pins emp_generic_mgt_0/CH3_MGT_USRWORD_i]
connect_bd_net [get_bd_pins emp_lpgbt_3/int_lpgbt_resp] [get_bd_pins xlconcat_3/In0]
connect_bd_net [get_bd_pins emp_lpgbt_3/status_emp_lpgbt_o] [get_bd_pins empfw_debughub_0/status_emp_lpgbt_3]
connect_bd_net [get_bd_pins emp_lpgbt_4/MGT_RXSlide_o] [get_bd_pins emp_generic_mgt_0/CH4_MGT_RXSlide_i]
connect_bd_net [get_bd_pins emp_lpgbt_4/MGT_USRWORD_o] [get_bd_pins emp_generic_mgt_0/CH4_MGT_USRWORD_i]
connect_bd_net [get_bd_pins emp_lpgbt_4/int_lpgbt_resp] [get_bd_pins xlconcat_3/In1]
connect_bd_net [get_bd_pins emp_lpgbt_4/status_emp_lpgbt_o] [get_bd_pins empfw_debughub_0/status_emp_lpgbt_4]
connect_bd_net [get_bd_pins emp_lpgbt_5/MGT_RXSlide_o] [get_bd_pins emp_generic_mgt_0/CH5_MGT_RXSlide_i]
connect_bd_net [get_bd_pins emp_lpgbt_5/MGT_USRWORD_o] [get_bd_pins emp_generic_mgt_0/CH5_MGT_USRWORD_i]
connect_bd_net [get_bd_pins emp_lpgbt_5/int_lpgbt_resp] [get_bd_pins xlconcat_3/In2]
connect_bd_net [get_bd_pins emp_lpgbt_5/status_emp_lpgbt_o] [get_bd_pins empfw_debughub_0/status_emp_lpgbt_5]
connect_bd_net [get_bd_pins emp_lpgbt_6/MGT_RXSlide_o] [get_bd_pins emp_generic_mgt_0/CH6_MGT_RXSlide_i]
connect_bd_net [get_bd_pins emp_lpgbt_6/MGT_USRWORD_o] [get_bd_pins emp_generic_mgt_0/CH6_MGT_USRWORD_i]
connect_bd_net [get_bd_pins emp_lpgbt_6/int_lpgbt_resp] [get_bd_pins xlconcat_4/In0]
connect_bd_net [get_bd_pins emp_lpgbt_6/status_emp_lpgbt_o] [get_bd_pins empfw_debughub_0/status_emp_lpgbt_6]
connect_bd_net [get_bd_pins emp_lpgbt_7/MGT_RXSlide_o] [get_bd_pins emp_generic_mgt_0/CH7_MGT_RXSlide_i]
connect_bd_net [get_bd_pins emp_lpgbt_7/MGT_USRWORD_o] [get_bd_pins emp_generic_mgt_0/CH7_MGT_USRWORD_i]
connect_bd_net [get_bd_pins emp_lpgbt_7/int_lpgbt_resp] [get_bd_pins xlconcat_4/In1]
connect_bd_net [get_bd_pins emp_lpgbt_7/status_emp_lpgbt_o] [get_bd_pins empfw_debughub_0/status_emp_lpgbt_7]
connect_bd_net [get_bd_pins emp_lpgbt_8/MGT_RXSlide_o] [get_bd_pins emp_generic_mgt_0/CH8_MGT_RXSlide_i]
connect_bd_net [get_bd_pins emp_lpgbt_8/MGT_USRWORD_o] [get_bd_pins emp_generic_mgt_0/CH8_MGT_USRWORD_i]
connect_bd_net [get_bd_pins emp_lpgbt_8/int_lpgbt_resp] [get_bd_pins xlconcat_4/In2]
connect_bd_net [get_bd_pins emp_lpgbt_8/status_emp_lpgbt_o] [get_bd_pins empfw_debughub_0/status_emp_lpgbt_8]
connect_bd_net [get_bd_pins emp_lpgbt_9/MGT_RXSlide_o] [get_bd_pins emp_generic_mgt_0/CH9_MGT_RXSlide_i]
connect_bd_net [get_bd_pins emp_lpgbt_9/MGT_USRWORD_o] [get_bd_pins emp_generic_mgt_0/CH9_MGT_USRWORD_i]
connect_bd_net [get_bd_pins emp_lpgbt_9/int_lpgbt_resp] [get_bd_pins xlconcat_5/In0]
connect_bd_net [get_bd_pins emp_lpgbt_9/status_emp_lpgbt_o] [get_bd_pins empfw_debughub_0/status_emp_lpgbt_9]
connect_bd_net [get_bd_pins empfw_debughub_0/MGT_RXRESET_o] [get_bd_pins emp_generic_mgt_0/MGT_RXRESET_FF_i]
connect_bd_net [get_bd_pins empfw_debughub_0/MGT_TXRESET_o] [get_bd_pins emp_generic_mgt_0/MGT_TXRESET_FF_i]
connect_bd_net [get_bd_pins empfw_debughub_0/rst_emp_lpgbt_0] [get_bd_pins emp_lpgbt_0/EXT_RST]
connect_bd_net [get_bd_pins empfw_debughub_0/rst_emp_lpgbt_1] [get_bd_pins emp_lpgbt_1/EXT_RST]
connect_bd_net [get_bd_pins empfw_debughub_0/rst_emp_lpgbt_2] [get_bd_pins emp_lpgbt_2/EXT_RST]
connect_bd_net [get_bd_pins empfw_debughub_0/rst_emp_lpgbt_3] [get_bd_pins emp_lpgbt_3/EXT_RST]
connect_bd_net [get_bd_pins empfw_debughub_0/rst_emp_lpgbt_4] [get_bd_pins emp_lpgbt_4/EXT_RST]
connect_bd_net [get_bd_pins empfw_debughub_0/rst_emp_lpgbt_5] [get_bd_pins emp_lpgbt_5/EXT_RST]
connect_bd_net [get_bd_pins empfw_debughub_0/rst_emp_lpgbt_6] [get_bd_pins emp_lpgbt_6/EXT_RST]
connect_bd_net [get_bd_pins empfw_debughub_0/rst_emp_lpgbt_7] [get_bd_pins emp_lpgbt_7/EXT_RST]
connect_bd_net [get_bd_pins empfw_debughub_0/rst_emp_lpgbt_8] [get_bd_pins emp_lpgbt_8/EXT_RST]
connect_bd_net [get_bd_pins empfw_debughub_0/rst_emp_lpgbt_9] [get_bd_pins emp_lpgbt_9/EXT_RST]
connect_bd_net [get_bd_pins empfw_debughub_0/rst_emp_lpgbt_10] [get_bd_pins emp_lpgbt_10/EXT_RST]
connect_bd_net [get_bd_pins empfw_debughub_0/rst_emp_lpgbt_11] [get_bd_pins emp_lpgbt_11/EXT_RST]
connect_bd_net [get_bd_pins xlconcat_0/dout] [get_bd_pins zynq_ultra_ps_e_0/pl_ps_irq0]
connect_bd_net [get_bd_pins xlconcat_2/dout] [get_bd_pins axi_intc_0/intr]
connect_bd_net [get_bd_pins xlconcat_3/dout] [get_bd_pins axi_intc_1/intr]
connect_bd_net [get_bd_pins xlconcat_4/dout] [get_bd_pins axi_intc_2/intr]
connect_bd_net [get_bd_pins xlconcat_5/dout] [get_bd_pins axi_intc_3/intr]
connect_bd_net [get_bd_pins zynq_ultra_ps_e_0/pl_clk0] \
  [get_bd_pins zynq_ultra_ps_e_0/maxihpm0_fpd_aclk] [get_bd_pins zynq_ultra_ps_e_0/maxihpm1_fpd_aclk] \
  [get_bd_pins axi_interconnect_1/ACLK] [get_bd_pins axi_interconnect_1/S00_ACLK] [get_bd_pins axi_interconnect_1/M00_ACLK] \
  [get_bd_pins axi_interconnect_0/ACLK] [get_bd_pins axi_interconnect_0/S00_ACLK] [get_bd_pins axi_interconnect_0/M00_ACLK] \
  [get_bd_pins axi_interconnect_0/M01_ACLK] [get_bd_pins axi_interconnect_0/M02_ACLK] \
  [get_bd_pins axi_interconnect_0/M03_ACLK] [get_bd_pins axi_interconnect_0/M11_ACLK] \
  [get_bd_pins axi_interconnect_0/M10_ACLK] [get_bd_pins axi_interconnect_0/M09_ACLK] \
  [get_bd_pins axi_interconnect_0/M08_ACLK] [get_bd_pins axi_interconnect_0/M07_ACLK] \
  [get_bd_pins axi_interconnect_0/M06_ACLK] [get_bd_pins axi_interconnect_0/M05_ACLK] \
  [get_bd_pins axi_interconnect_0/M04_ACLK] [get_bd_pins proc_sys_reset_0/slowest_sync_clk] \
  [get_bd_pins emp_lpgbt_0/axi_aclk] [get_bd_pins emp_lpgbt_10/axi_aclk] [get_bd_pins emp_lpgbt_11/axi_aclk] \
  [get_bd_pins emp_lpgbt_1/axi_aclk] [get_bd_pins emp_lpgbt_2/axi_aclk] [get_bd_pins emp_lpgbt_3/axi_aclk] \
  [get_bd_pins emp_lpgbt_4/axi_aclk] [get_bd_pins emp_lpgbt_5/axi_aclk] [get_bd_pins emp_lpgbt_6/axi_aclk] \
  [get_bd_pins emp_lpgbt_7/axi_aclk] [get_bd_pins emp_lpgbt_8/axi_aclk] [get_bd_pins emp_lpgbt_9/axi_aclk] \
  [get_bd_pins empfw_debughub_0/axi_aclk] [get_bd_pins axi_intc_3/s_axi_aclk] [get_bd_pins axi_intc_2/s_axi_aclk] \
  [get_bd_pins axi_intc_1/s_axi_aclk] [get_bd_pins axi_intc_0/s_axi_aclk] [get_bd_pins axi_interconnect_0/M12_ACLK] \
  [get_bd_pins axi_interconnect_0/M13_ACLK] [get_bd_pins axi_interconnect_0/M14_ACLK] \
  [get_bd_pins axi_interconnect_0/M15_ACLK] [get_bd_pins emp_generic_mgt_0/MGT_FREEDRPCLK_i]
connect_bd_net [get_bd_pins zynq_ultra_ps_e_0/pl_resetn0] [get_bd_pins proc_sys_reset_0/ext_reset_in]

# ---- address map ----
assign_bd_address -offset 0x00A0000000 -range 16K -target_address_space [get_bd_addr_spaces zynq_ultra_ps_e_0/Data] [get_bd_addr_segs emp_lpgbt_0/s_axi/reg0]
assign_bd_address -offset 0x00A0010000 -range 16K -target_address_space [get_bd_addr_spaces zynq_ultra_ps_e_0/Data] [get_bd_addr_segs emp_lpgbt_1/s_axi/reg0]
assign_bd_address -offset 0x00A0020000 -range 16K -target_address_space [get_bd_addr_spaces zynq_ultra_ps_e_0/Data] [get_bd_addr_segs emp_lpgbt_2/s_axi/reg0]
assign_bd_address -offset 0x00A0030000 -range 16K -target_address_space [get_bd_addr_spaces zynq_ultra_ps_e_0/Data] [get_bd_addr_segs emp_lpgbt_3/s_axi/reg0]
assign_bd_address -offset 0x00A0040000 -range 16K -target_address_space [get_bd_addr_spaces zynq_ultra_ps_e_0/Data] [get_bd_addr_segs emp_lpgbt_4/s_axi/reg0]
assign_bd_address -offset 0x00A0050000 -range 16K -target_address_space [get_bd_addr_spaces zynq_ultra_ps_e_0/Data] [get_bd_addr_segs emp_lpgbt_5/s_axi/reg0]
assign_bd_address -offset 0x00A0060000 -range 16K -target_address_space [get_bd_addr_spaces zynq_ultra_ps_e_0/Data] [get_bd_addr_segs emp_lpgbt_6/s_axi/reg0]
assign_bd_address -offset 0x00A0070000 -range 16K -target_address_space [get_bd_addr_spaces zynq_ultra_ps_e_0/Data] [get_bd_addr_segs emp_lpgbt_7/s_axi/reg0]
assign_bd_address -offset 0x00A0080000 -range 16K -target_address_space [get_bd_addr_spaces zynq_ultra_ps_e_0/Data] [get_bd_addr_segs emp_lpgbt_8/s_axi/reg0]
assign_bd_address -offset 0x00A0090000 -range 16K -target_address_space [get_bd_addr_spaces zynq_ultra_ps_e_0/Data] [get_bd_addr_segs emp_lpgbt_9/s_axi/reg0]
assign_bd_address -offset 0x00A00A0000 -range 16K -target_address_space [get_bd_addr_spaces zynq_ultra_ps_e_0/Data] [get_bd_addr_segs emp_lpgbt_10/s_axi/reg0]
assign_bd_address -offset 0x00A00B0000 -range 16K -target_address_space [get_bd_addr_spaces zynq_ultra_ps_e_0/Data] [get_bd_addr_segs emp_lpgbt_11/s_axi/reg0]
assign_bd_address -offset 0x00A00C0000 -range 64K -target_address_space [get_bd_addr_spaces zynq_ultra_ps_e_0/Data] [get_bd_addr_segs axi_intc_0/S_AXI/Reg]
assign_bd_address -offset 0x00A00D0000 -range 64K -target_address_space [get_bd_addr_spaces zynq_ultra_ps_e_0/Data] [get_bd_addr_segs axi_intc_1/S_AXI/Reg]
assign_bd_address -offset 0x00A00E0000 -range 64K -target_address_space [get_bd_addr_spaces zynq_ultra_ps_e_0/Data] [get_bd_addr_segs axi_intc_2/S_AXI/Reg]
assign_bd_address -offset 0x00A00F0000 -range 64K -target_address_space [get_bd_addr_spaces zynq_ultra_ps_e_0/Data] [get_bd_addr_segs axi_intc_3/S_AXI/Reg]
assign_bd_address -offset 0x00B0000000 -range 16K -target_address_space [get_bd_addr_spaces zynq_ultra_ps_e_0/Data] [get_bd_addr_segs empfw_debughub_0/s_axi/reg0]

validate_bd_design
save_bd_design
